# Altium schematic sheet Sub-A_BPF.SchDoc
size A; SheetNumber: 1; SheetTotal: 1
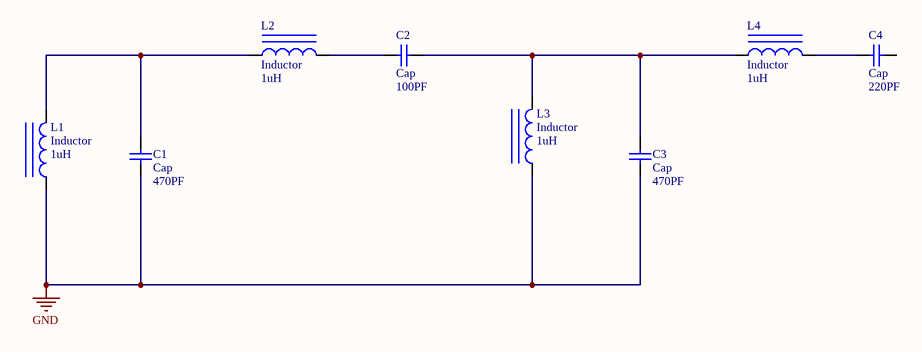
[diagram p0: Sub-A_BPF.SchDoc]

## Parts
C1  Cap  value 470PF  [RADIAL-0.1]
C2  Cap  value 100PF  [RADIAL-0.1]
C3  Cap  value 470PF  [RADIAL-0.1]
C4  Cap  value 220PF  [RADIAL-0.1]
L1  Inductor  value 1uH  [TORIND-T25]
L2  Inductor  value 1uH  [TORIND-T25]
L3  Inductor  value 1uH  [TORIND-T25]
L4  Inductor  value 1uH  [TORIND-T25]

## Nets
GND: C1.1 C3.2 L1.1 L3.1
NetC1_2: C1.2 L1.2 L2.1
NetC2_1: C2.1 L2.2
NetC2_2: C2.2 C3.1 L3.2 L4.1
NetC4_1: C4.1 L4.2

Not connected (* = marked no-connect by the designer): C4 2

## Library data of the parts
C1 C3 = CAP CER 470PF 50V X7R RADIAL: Capacitor; Manufacturer Part Number: K471K15X7RF53L2; Designator: C?; Voltage Rating: 50V; Published: 8-Jun-2000; LatestRevisionDate: 17-Jul-2002; LatestRevisionNote: Re-released for DXP Platform.; Publisher: Altium Limited
C2 = CAP CER 100PF 50V C0G/NP0 RADIAL: Capacitor; Manufacturer Part Number: K101K15C0GF53L2; Designator: C?; Voltage Rating: 50V; Published: 8-Jun-2000; LatestRevisionDate: 17-Jul-2002; LatestRevisionNote: Re-released for DXP Platform.; Publisher: Altium Limited
C4 = CAP CER 220PF 50V X7R RADIAL: Capacitor; Manufacturer Part Number: K221K15X7RF5TH5; Designator: C?; Voltage Rating: 50V; Published: 8-Jun-2000; LatestRevisionDate: 17-Jul-2002; LatestRevisionNote: Re-released for DXP Platform.; Publisher: Altium Limited
L1-L4 = Toroidal inductor ferrite core: Designator: L?; Published: 8-Jun-2000; LatestRevisionDate: 29-May-2009; LatestRevisionNote: IPC-7351 Footprint Added.; Publisher: Altium Limited